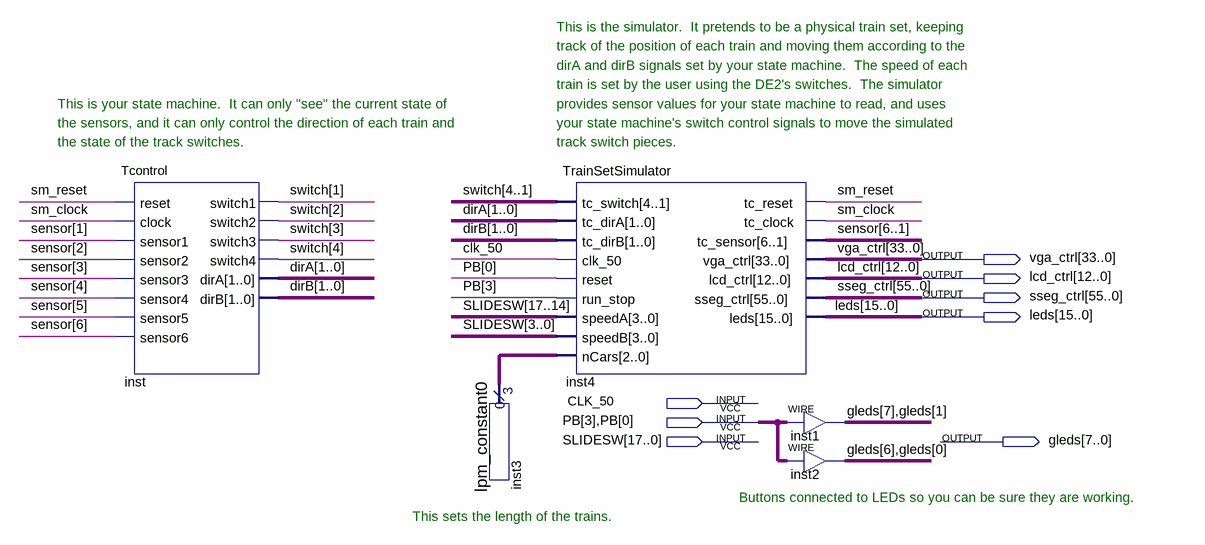
[diagram p0: schematic sheet]
// Quartus schematic TrainTop.bdf as structural Verilog: 5 symbols, 8 pins
module TrainTop (
  input  CLK_50,
  input  [3:0] PB,
  input  [17:0] SLIDESW,
  output [33:0] vga_ctrl,
  output [12:0] lcd_ctrl,
  output [55:0] sseg_ctrl,
  output [15:0] leds,
  output [7:0] gleds
);

  wire sm_clock, sm_reset;
  wire [1:0] dirA, dirB;
  wire [2:0] inst3_result;
  wire [4:1] switch;
  wire [6:1] sensor;

  Tcontrol inst (
    .reset(sm_reset), .clock(sm_clock), .sensor1(sensor[1]), .sensor2(sensor[2]), .sensor3(sensor[3]),
    .sensor4(sensor[4]), .sensor5(sensor[5]), .sensor6(sensor[6]), .switch1(switch[1]), .switch2(switch[2]),
    .switch3(switch[3]), .switch4(switch[4]), .dirA(dirA), .dirB(dirB));
  lpm_constant0 inst3 (.result(inst3_result));
  TrainSetSimulator inst4 (
    .tc_switch(switch), .tc_dirA(dirA), .tc_dirB(dirB), .clk_50(CLK_50), .reset(PB[0]), .run_stop(PB[3]),
    .speedA(SLIDESW[17:14]), .speedB(SLIDESW[3:0]), .nCars(inst3_result), .tc_reset(sm_reset),
    .tc_clock(sm_clock), .tc_sensor(sensor), .vga_ctrl(vga_ctrl), .lcd_ctrl(lcd_ctrl), .sseg_ctrl(sseg_ctrl),
    .leds(leds));
  assign {gleds[7], gleds[1]} = {PB[3], PB[0]};  // WIRE inst1
  assign {gleds[6], gleds[0]} = {PB[3], PB[0]};  // WIRE inst2

  // Notes on the sheet:
  //   This is the simulator.  It pretends to be a physical train set, keeping
  //   track of the position of each train and moving them according to the
  //   dirA and dirB signals set by your state machine.  The speed of each
  //   train is set by the user using the DE2's switches.  The simulator
  //   This is your state machine.  It can only "see" the current state of
  //   provides sensor values for your state machine to read, and uses
  //   the sensors, and it can only control the direction of each train and
  //   your state machine's switch control signals to move the simulated
  //   the state of the track switches.
  //   track switch pieces.
  //   Buttons connected to LEDs so you can be sure they are working.
  //   This sets the length of the trains.
endmodule
